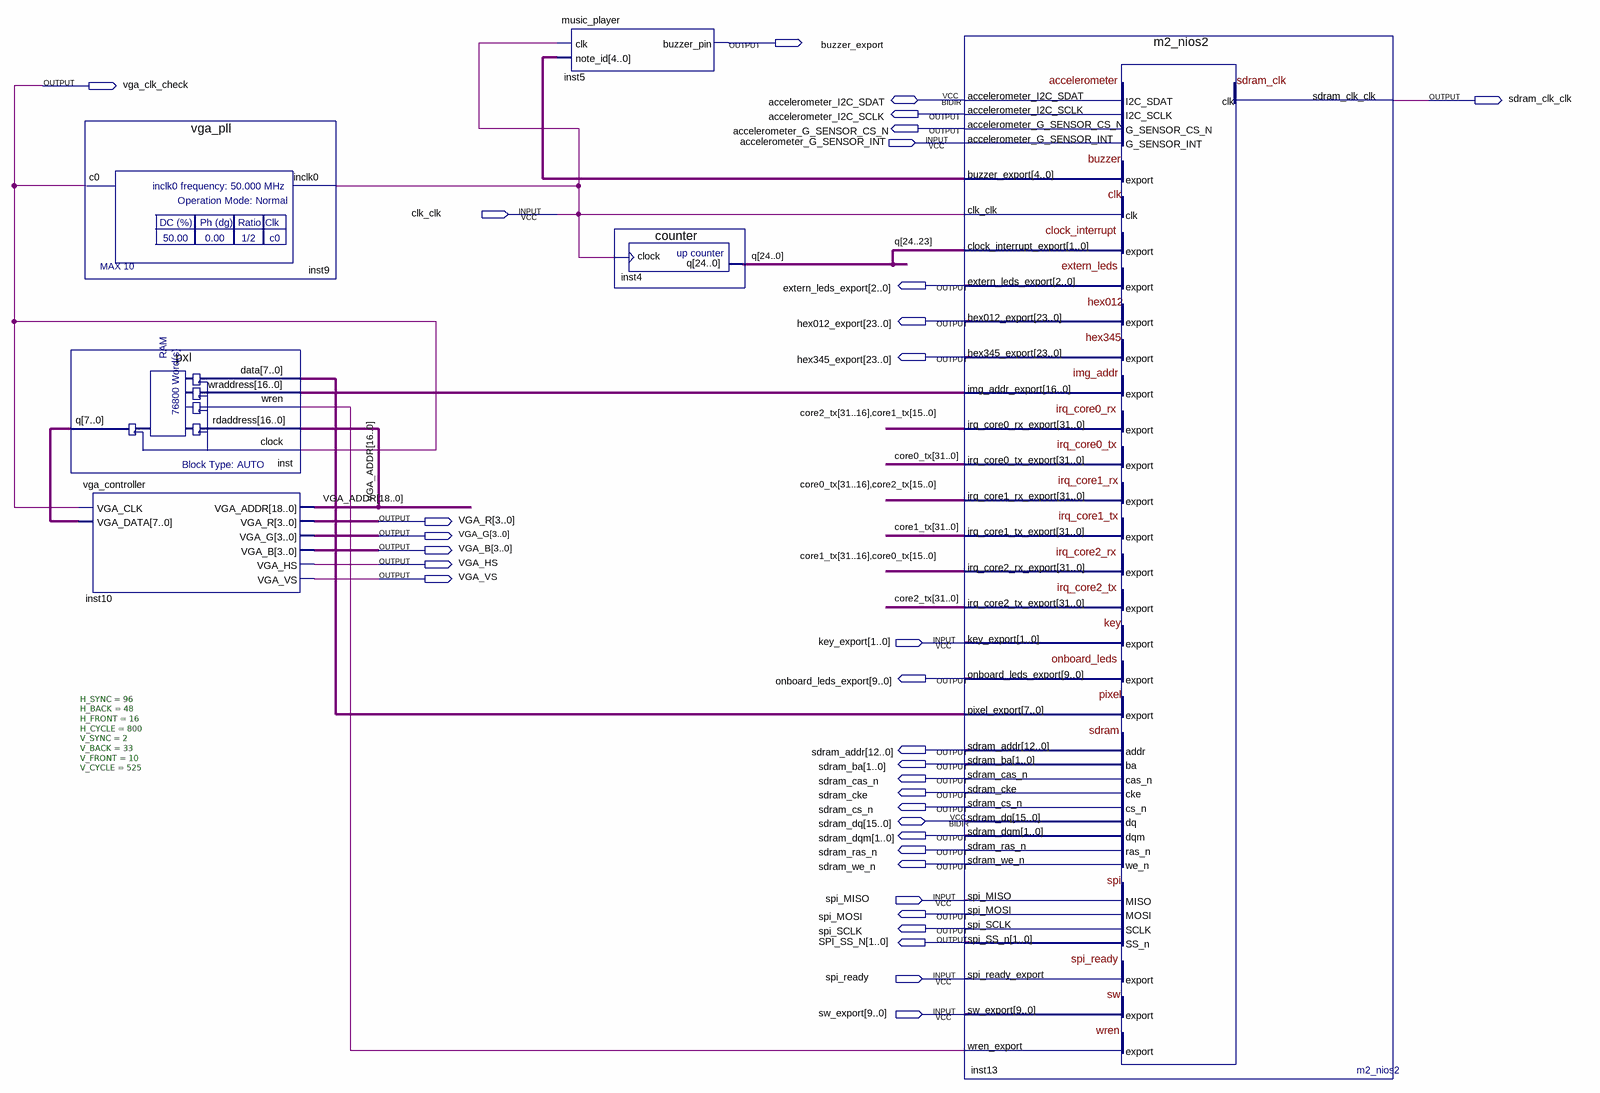
[diagram p0: schematic sheet]
// Quartus schematic milestone2.bdf as structural Verilog: 6 symbols, 33 pins
module milestone2 (
  input  accelerometer_G_SENSOR_INT,
  input  clk_clk,
  input  [1:0] key_export,
  input  spi_MISO,
  input  spi_ready,
  input  [9:0] sw_export,
  inout  accelerometer_I2C_SDAT,
  inout  [15:0] sdram_dq,
  output buzzer_export,
  output vga_clk_check,
  output sdram_clk_clk,
  output accelerometer_I2C_SCLK,
  output accelerometer_G_SENSOR_CS_N,
  output [2:0] extern_leds_export,
  output [23:0] hex012_export,
  output [23:0] hex345_export,
  output [3:0] VGA_R,
  output [3:0] VGA_G,
  output [3:0] VGA_B,
  output VGA_HS,
  output VGA_VS,
  output [9:0] onboard_leds_export,
  output [12:0] sdram_addr,
  output [1:0] sdram_ba,
  output sdram_cas_n,
  output sdram_cke,
  output sdram_cs_n,
  output [1:0] sdram_dqm,
  output sdram_ras_n,
  output sdram_we_n,
  output spi_MOSI,
  output spi_SCLK,
  output [1:0] SPI_SS_N
);

  wire inst13_wren_export;
  wire [4:0] inst13_buzzer_export;
  wire [7:0] inst13_pixel_export, inst_q;
  wire [16:0] inst13_img_addr_export;
  wire [18:0] VGA_ADDR;
  wire [24:0] q;
  wire [31:0] core0_tx, core1_tx, core2_tx;

  vga_pll inst9 (.inclk0(clk_clk), .c0(vga_clk_check));
  pxl inst (
    .data(inst13_pixel_export), .wraddress(inst13_img_addr_export), .wren(inst13_wren_export),
    .rdaddress(VGA_ADDR[16:0]), .clock(vga_clk_check), .q(inst_q));
  vga_controller #(.H_SYNC(96), .H_BACK(48), .H_FRONT(16), .H_CYCLE(800), .V_SYNC(2), .V_BACK(33), .V_FRONT(10), .V_CYCLE(525)) inst10 (
    .VGA_CLK(vga_clk_check), .VGA_DATA(inst_q), .VGA_ADDR(VGA_ADDR), .VGA_R(VGA_R), .VGA_G(VGA_G),
    .VGA_B(VGA_B), .VGA_HS(VGA_HS), .VGA_VS(VGA_VS));
  music_player inst5 (.clk(clk_clk), .note_id(inst13_buzzer_export), .buzzer_pin(buzzer_export));
  counter inst4 (.clock(clk_clk), .q(q));
  m2_nios2 inst13 (
    .accelerometer_G_SENSOR_INT(accelerometer_G_SENSOR_INT), .clk_clk(clk_clk),
    .clock_interrupt_export(q[24:23]), .irq_core0_rx_export({core2_tx[31:16], core1_tx[15:0]}),
    .irq_core1_rx_export({core0_tx[31:16], core2_tx[15:0]}),
    .irq_core2_rx_export({core1_tx[31:16], core0_tx[15:0]}), .key_export(key_export), .spi_MISO(spi_MISO),
    .spi_ready_export(spi_ready), .sw_export(sw_export), .accelerometer_I2C_SCLK(accelerometer_I2C_SCLK),
    .accelerometer_G_SENSOR_CS_N(accelerometer_G_SENSOR_CS_N), .buzzer_export(inst13_buzzer_export),
    .extern_leds_export(extern_leds_export), .hex012_export(hex012_export), .hex345_export(hex345_export),
    .img_addr_export(inst13_img_addr_export), .irq_core0_tx_export(core0_tx), .irq_core1_tx_export(core1_tx),
    .irq_core2_tx_export(core2_tx), .onboard_leds_export(onboard_leds_export),
    .pixel_export(inst13_pixel_export), .sdram_addr(sdram_addr), .sdram_ba(sdram_ba),
    .sdram_cas_n(sdram_cas_n), .sdram_cke(sdram_cke), .sdram_cs_n(sdram_cs_n), .sdram_dqm(sdram_dqm),
    .sdram_ras_n(sdram_ras_n), .sdram_we_n(sdram_we_n), .sdram_clk_clk(sdram_clk_clk), .spi_MOSI(spi_MOSI),
    .spi_SCLK(spi_SCLK), .spi_SS_n(SPI_SS_N), .wren_export(inst13_wren_export),
    .accelerometer_I2C_SDAT(accelerometer_I2C_SDAT), .sdram_dq(sdram_dq));
endmodule
